# EAGLE design proto_01 (EAGLE 7.3.0)
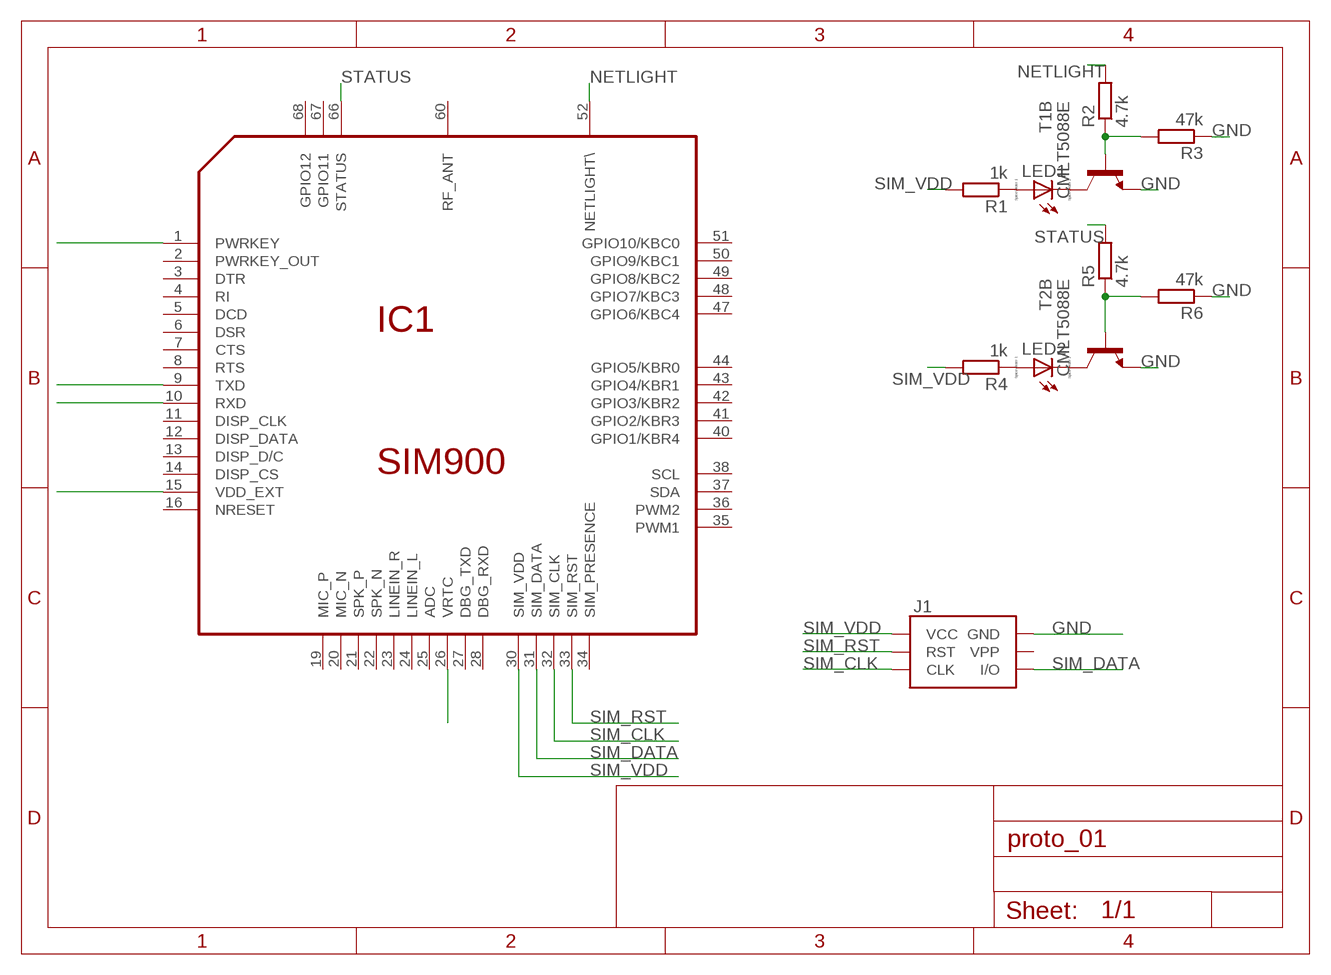
[diagram p0: schematic, sheet 1]

## Parts
IC1  SIM900  [SIM900]
J1  SIMHOLDERSIM  [SIMHOLDER]
LED1  LED_ESML0603  [LED_SML0603]
LED2  LED_ESML0603  [LED_SML0603]
R1  1k  R-EU_R0805  [R0805]
R2  4.7k  R-EU_R0805  [R0805]
R3  47k  R-EU_R0805  [R0805]
R4  1k  R-EU_R0805  [R0805]
R5  4.7k  R-EU_R0805  [R0805]
R6  47k  R-EU_R0805  [R0805]
T1  CMLT5088E  [SOT563]
T2  CMLT5088E  [SOT563]

## Nets
GND: J1.C5(GND) R3.1 R6.1 T1.4(B:E) T2.4(B:E)
N$1: IC1.1(PWRKEY)
N$2: IC1.9(TXD)
N$3: IC1.10(RXD)
N$4: IC1.15(VDD_EXT)
N$5: IC1.26(VRTC)
N$6: LED1.C T1.3(B:C)
N$7: LED1.A R1.1
N$8: R2.1 R3.2 T1.5(B:B)
N$9: LED2.C T2.3(B:C)
N$10: LED2.A R4.1
N$11: R5.1 R6.2 T2.5(B:B)
NETLIGHT: IC1.52(NETLIGHT\) R2.2
SIM_CLK: IC1.32(SIM_CLK) J1.C3(CLK)
SIM_DATA: IC1.31(SIM_DATA) J1.C7(I/O)
SIM_RST: IC1.33(SIM_RST) J1.C2(RST)
SIM_VDD: IC1.30(SIM_VDD) J1.C1(VCC) R1.2 R4.2
STATUS: IC1.66(STATUS) R5.2
Unconnected: IC1.2(PWRKEY_OUT) IC1.3(DTR) IC1.4(RI) IC1.5(DCD) IC1.6(DSR) IC1.7(CTS) IC1.8(RTS) IC1.11(DISP_CLK) IC1.12(DISP_DATA) IC1.13(DISP_D/C) IC1.14(DISP_CS) IC1.16(NRESET) IC1.19(MIC_P) IC1.20(MIC_N) IC1.21(SPK_P) IC1.22(SPK_N) IC1.23(LINEIN_R) IC1.24(LINEIN_L) IC1.25(ADC) IC1.27(DBG_TXD) IC1.28(DBG_RXD) IC1.34(SIM_PRESENCE) IC1.35(PWM1) IC1.36(PWM2) IC1.37(SDA) IC1.38(SCL) IC1.40(GPIO1/KBR4) IC1.41(GPIO2/KBR3) IC1.42(GPIO3/KBR2) IC1.43(GPIO4/KBR1) IC1.44(GPIO5/KBR0) IC1.47(GPIO6/KBC4) IC1.48(GPIO7/KBC3) IC1.49(GPIO8/KBC2) IC1.50(GPIO9/KBC1) IC1.51(GPIO10/KBC0) IC1.60(RF_ANT) IC1.67(GPIO11) IC1.68(GPIO12) J1.C6(VPP) T1.1(A:E) T1.2(A:B) T1.6(A:C) T2.1(A:E) T2.2(A:B) T2.6(A:C)

## Power pins joined to a net without a drawn wire
GND: IC1.17(GND) IC1.18(GND) IC1.29(GND) IC1.39(GND) IC1.45(GND) IC1.46(GND) IC1.53(GND) IC1.54(GND) IC1.58(GND) IC1.59(GND) IC1.61(GND) IC1.62(GND) IC1.63(GND) IC1.64(GND) IC1.65(GND)
VBAT: IC1.55(VBAT) IC1.56(VBAT) IC1.57(VBAT)

## Library data of the parts
IC1 = sim900:SIM900
J1 = SparkFun-Connectors:SIMHOLDER: SIM Socket Socket for SIM cellular cards. Schematic element and footprint production proven. Spark Fun Electronics SKU : PRT-00548; PROD_ID: CONN-08536
LED1 LED2 = eagle-ltspice:LED_E: LED Source: http://www.osram.convergy.de Source: www.luxeon.com Source: www.kingbright.com; SPICEMODEL: NONE; SPICEPREFIX: D; SPICETYPE: diode
R1-R6 = resistor:R-EU_: RESISTOR, European symbol
T1 T2 = transistor-neu-to92:CMLT5088E: DUAL NPN/NPN L88 TRANSISTORS ENHANCED SPECIFICATION PICOmini(TM) SURFACE MOUNT Source: CMLT5078%20SERIES.pdf

## Board
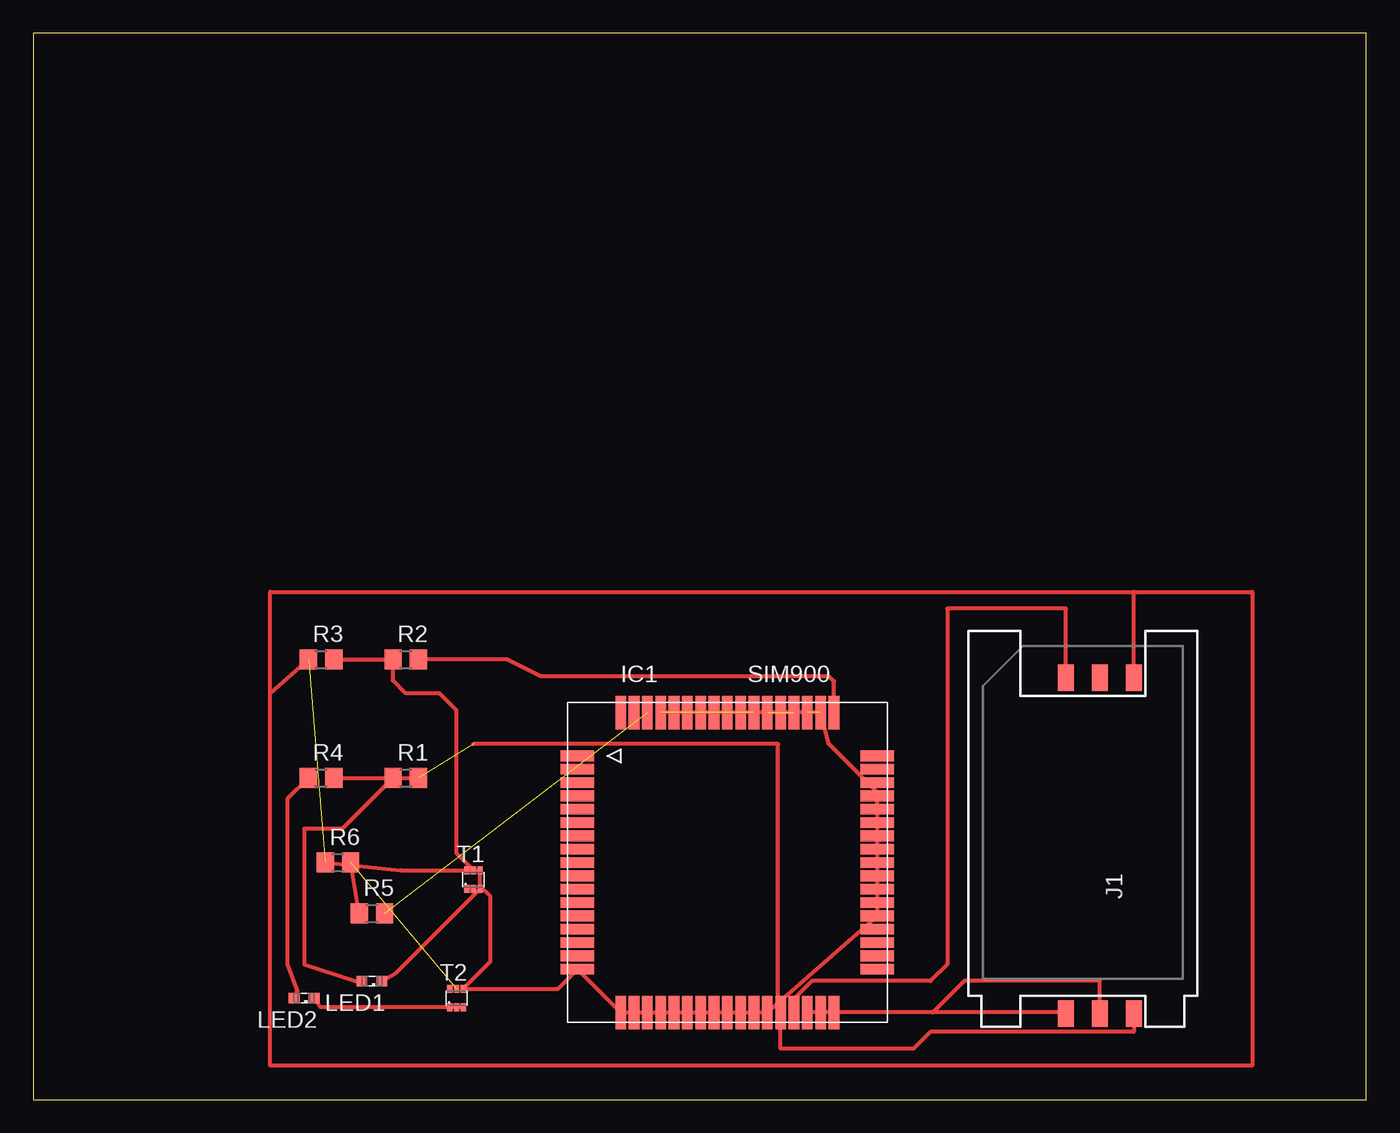
[diagram p1: board, top side]

Size 100 x 80 mm. Coordinates in mm from the lower left corner, seen from the top.
Outline: 0,0 100,0 100,80 0,80 0,0
Copper layers (1*16): Top 0.035mm / dielectric 1.5mm / Bottom 0.035mm
Design rules "default": minimum track width 10mil, minimum drill 24mil, track to track 8mil, track to pad 8mil, pad to pad 8mil, via to via 8mil, smd to smd 8mil, copper to edge 40mil, drill to drill 8mil, minimum pad ring 10mil, minimum via ring 8mil, stop-mask expansion 4mil, vias tented up to drill 0mil, thermal gap 10mil

### Footprints (pad centres in the part's own frame; a part is rotated, then mirrored left to right if it is on the bottom)
SIM900 = smd 2.5 x 0.8: 1 -11.25,8; 2 -11.25,7; 3 -11.25,6; 4 -11.25,5; 5 -11.25,4; 6 -11.25,3; 7 -11.25,2; 8 -11.25,1; 9 -11.25,0; 10 -11.25,-1; 11 -11.25,-2; 12 -11.25,-3; 13 -11.25,-4; 14 -11.25,-5; 15 -11.25,-6; 16 -11.25,-7; 17 -11.25,-8; 35 11.25,-8; 36 11.25,-7; 37 11.25,-6; 38 11.25,-5; 39 11.25,-4; 40 11.25,-3; 41 11.25,-2; 42 11.25,-1; 43 11.25,0; 44 11.25,1; 45 11.25,2; 46 11.25,3; 47 11.25,4; 48 11.25,5; 49 11.25,6; 50 11.25,7; 51 11.25,8 | smd 0.8 x 2.5: 18 -8,-11.25; 19 -7,-11.25; 20 -6,-11.25; 21 -5,-11.25; 22 -4,-11.25; 23 -3,-11.25; 24 -2,-11.25; 25 -1,-11.25; 26 0,-11.25; 27 1,-11.25; 28 2,-11.25; 29 3,-11.25; 30 4,-11.25; 31 5,-11.25; 32 6,-11.25; 33 7,-11.25; 34 8,-11.25; 52 8,11.25; 53 7,11.25; 54 6,11.25; 55 5,11.25; 56 4,11.25; 57 3,11.25; 58 2,11.25; 59 1,11.25; 60 0,11.25; 61 -1,11.25; 62 -2,11.25; 63 -3,11.25; 64 -4,11.25; 65 -5,11.25; 66 -6,11.25; 67 -7,11.25; 68 -8,11.25
SIMHOLDER = smd 2 x 1.2: C1 -12.61,-3.81; C2 -12.61,-1.27; C3 -12.61,1.27; C5 12.61,-3.81; C6 12.61,-1.27; C7 12.61,1.27
LED_SML0603 = smd 0.8 x 0.8: A 0.75,0; C -0.75,0
R0805 = smd 1.3 x 1.5: 1 -0.95,0; 2 0.95,0
SOT563 = smd 0.4 x 0.6: 1 -0.5,-0.7; 2 0,-0.7; 3 0.5,-0.7; 4 0.5,0.7; 5 0,0.7; 6 -0.5,0.7

### Placement (x,y rotation side)
IC1  52.07,17.78 0 top
J1  78.74,19.05 90 top
LED1  25.4,8.89 180 top
LED2  20.32,7.62 180 top
R1  27.94,24.13 0 top
R2  27.94,33.02 0 top
R3  21.59,33.02 0 top
R4  21.59,24.13 0 top
R5  25.4,13.97 0 top
R6  22.86,17.78 0 top
T1  33.02,16.51 0 top
T2  31.75,7.62 0 top

### Tracks (layer width: path | path; a pad name or v marks a point on that pad's centre or on a via)
GND  (8 unrouted)
  Top 0.305: 82.55,38.1 17.78,38.1 17.78,30.48 | 82.55,38.1 91.44,38.1 91.44,2.54 17.78,2.54 17.78,30.48 | R3.1 17.78,30.48 | J1.C5 82.55,38.1 | IC1.65 IC1.53 59.69,26.67 63.32,23.04 IC1.46 IC1.45 IC1.39 IC1.29 IC1.18 IC1.17 39.36,8.32 T2.4 34.29,10.36 34.29,15.24 33.52,16.01 T1.4 27.56,17.21 R6.1
N$6
  Top 0.305: T1.3 27.19,9.48 LED1.C
N$7
  Top 0.305: R1.1 23.18,20.32 20.32,20.32 20.32,10.16 24.13,8.89 LED1.A
N$8
  Top 0.305: R3.2 R2.1 26.99,31.43 27.94,30.48 30.48,30.48 31.75,29.21 31.75,18.48 T1.5
N$9
  Top 0.305: T2.3 21.54,6.92 LED2.C
N$10
  Top 0.305: R4.1 19.05,22.54 19.05,10.16 19.8,8.14 LED2.A
N$11  (1 unrouted)
  Top 0.305: R5.1 R6.2
NETLIGHT
  Top 0.305: IC1.52 60.07,31.37 59.69,31.75 38.1,31.75 35.56,33.02 R2.2
SIM_CLK
  Top 0.305: J1.C3 77.38,6.53 IC1.32
SIM_DATA
  Top 0.305: J1.C7 77.47,36.83 68.58,36.83 68.58,10.16 67.31,8.89 58.42,8.89 57.15,7.62 57.15,6.61 IC1.31
SIM_RST
  Top 0.305: J1.C2 80.01,8.89 69.85,8.89 67.49,6.53 IC1.33
SIM_VDD  (1 unrouted)
  Top 0.305: R4.2 R1.2 | J1.C1 82.55,5.08 67.31,5.08 66.04,3.81 56.07,3.81 IC1.30 55.88,6.72 55.88,26.67 33.02,26.67
STATUS  (1 unrouted)
VBAT  (2 unrouted)